# Altium schematic sheet USB-eVo.SchDoc
size A; Author: Cristian Balint; Engineer: Cristian Balint
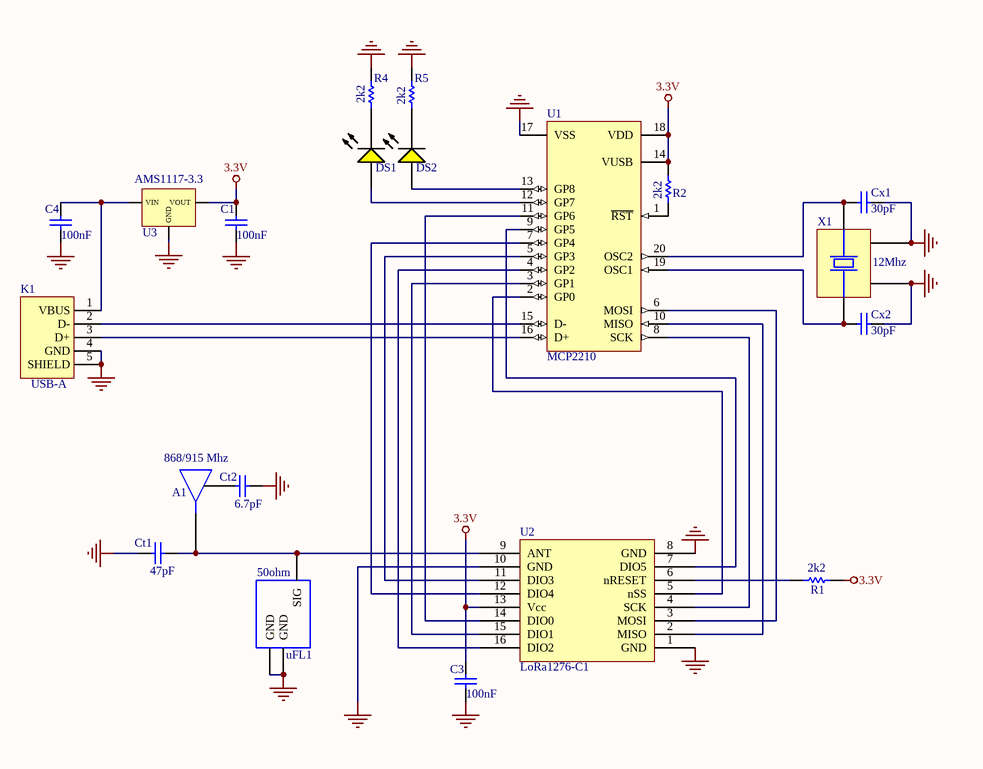
[diagram p0: USB-eVo.SchDoc]

## Parts
A1  868/915 Mhz  [M620720]
C1  100nF  [CAPC2013X88X50NL20T25]
C3  100nF  [CAPC2013X88X50NL20T25]
C4  100nF  [CAPC2013X88X50NL20T25]
Ct1  47pF  [SMD0402]
Ct2  6.7pF  [SMD0402]
Cx1  30pF  [PCB-ek4stckt8htl49c36kec-1]
Cx2  30pF  [PCB-ek4stckt8htl49c36kec-1]
DS1  LED-0603  [VISH-TLMX1100-2_V]  (value not drawn)
DS2  LED-0603  [VISH-TLMX1100-2_V]  (value not drawn)
K1  USB-A  [USB-A-H]
R1  2k2  [RESC1608X55X30LL15T15]
R2  2k2  [RESC1608X55X30LL15T15]
R4  2k2  [RESC1608X55X30LL15T15]
R5  2k2  [RESC1608X55X30LL15T15]
U1  MCP2210  [QFN-MQ20_N]
U2  LoRa1276-C1  [PCB-a2va5fqqikhnlzod9i25-1]
U3  AMS1117-3.3  [MP04A_N]
uFL1  50ohm  [HRS-U.FL-R-SMT_V]
X1  12Mhz  [PCB-o7tdnptwbjgdfbskc48q-1]

## Nets
3.3V: C1.2 C3.2 R1.1 R2.1 U1.14(VUSB) U1.18(VDD) U2.13(Vcc) U3.2(VOUT)
GND: A1.GND C1.1 C3.1 C4.1 Ct1.2 Ct2.1 Cx1.1 Cx2.1 K1.4(GND) K1.5(SHIELD) R4.2 R5.2 U1.17(VSS) U1.21(EP) U2.1(GND) U2.8(GND) U2.10(GND) U3.1(GND) uFL1.1(GND) uFL1.2(GND) X1.2(GND) X1.4(GND)
NetA1_1: A1.1(ANT) Ct1.1 U2.9(ANT) uFL1.3(SIG)
NetA1_2: A1.2(CAP) Ct2.2
NetC4_2: C4.2 K1.1(VBUS) U3.3(VIN)
NetCx1_2: Cx1.2 U1.20(OSC2) X1.3(X2)
NetCx2_2: Cx2.2 U1.19(OSC1) X1.1(X1)
NetDS1_1: DS1.1(A) U1.12(GP7)
NetDS1_2: DS1.2(K) R4.1
NetDS2_1: DS2.1(A) U1.13(GP8)
NetDS2_2: DS2.2(K) R5.1
NetK1_2: K1.2(D-) U1.15(D-)
NetK1_3: K1.3(D+) U1.16(D+)
NetR1_2: R1.2 U2.6(nRESET)
NetR2_2: R2.2 U1.1(~{RST})
NetU1_2: U1.2(GP0) U2.5(nSS)
NetU1_3: U1.3(GP1) U2.15(DIO1)
NetU1_4: U1.4(GP2) U2.16(DIO2)
NetU1_5: U1.5(GP3) U2.11(DIO3)
NetU1_6: U1.6(MOSI) U2.3(MOSI)
NetU1_7: U1.7(GP4) U2.12(DIO4)
NetU1_8: U1.8(SCK) U2.4(SCK)
NetU1_9: U1.9(GP5) U2.7(DIO5)
NetU1_10: U1.10(MISO) U2.2(MISO)
NetU1_11: U1.11(GP6) U2.14(DIO0)

## Notes on the sheet
- Title
- Size:
- Date:
- Tabloid
- Number:
- Time:
- Revision:
- Sheet
- of
- File:

## Library data of the parts
A1 = M620720: ISM 868/900MHz (6x2x1.08mm) - Antenna
C1 C3 C4 = CAP-0805: Ceramic Capacitor SMT 0805
Ct1 Ct2 = CAP-0402: Ceramic Capacitor SMT 0402
Cx1 Cx2 = CAP-0603: Ceramic Capacitor SMT 0603
DS1 DS2 = LED-0603: LED SMD 0603
K1 = USB-2.0-TYPE-A: Conn USB 2.0 Type A PL 4 POS 2mm/2.5mm Solder RA Thru-Hole 4 Terminal 1 Port Tray
R1 R2 R4 R5 = RES-0603: Thick Film Resistors - SMD 0603; Mounting Style: Surface Mount
U1 = MCP2210: USB-to-SPI Protocol Converter with GPIO (Master Mode), 20-Pin QFN, Industrial Temperature; Manufacturer Part Number: MCP2210-I/MQ; Data Rate: 12000000.0 bps; Lead-Free Status: Lead Free; Lifecycle Status: Active; Mounting Style: Surface Mount; Number of Pins: 20; RoHS: Compliant
U2 = NICERF-1276-C1
U3 = AMS1117: SOT223 1-Amp 3.3-Volt Low Drop Out Voltage Regulatator
uFL1 = uFL: Ultra Small Surface Mount Coaxial Connector, 50 Ohm
X1 = CRYSTAL: Crystal 32.0000mhz 18pf Smd